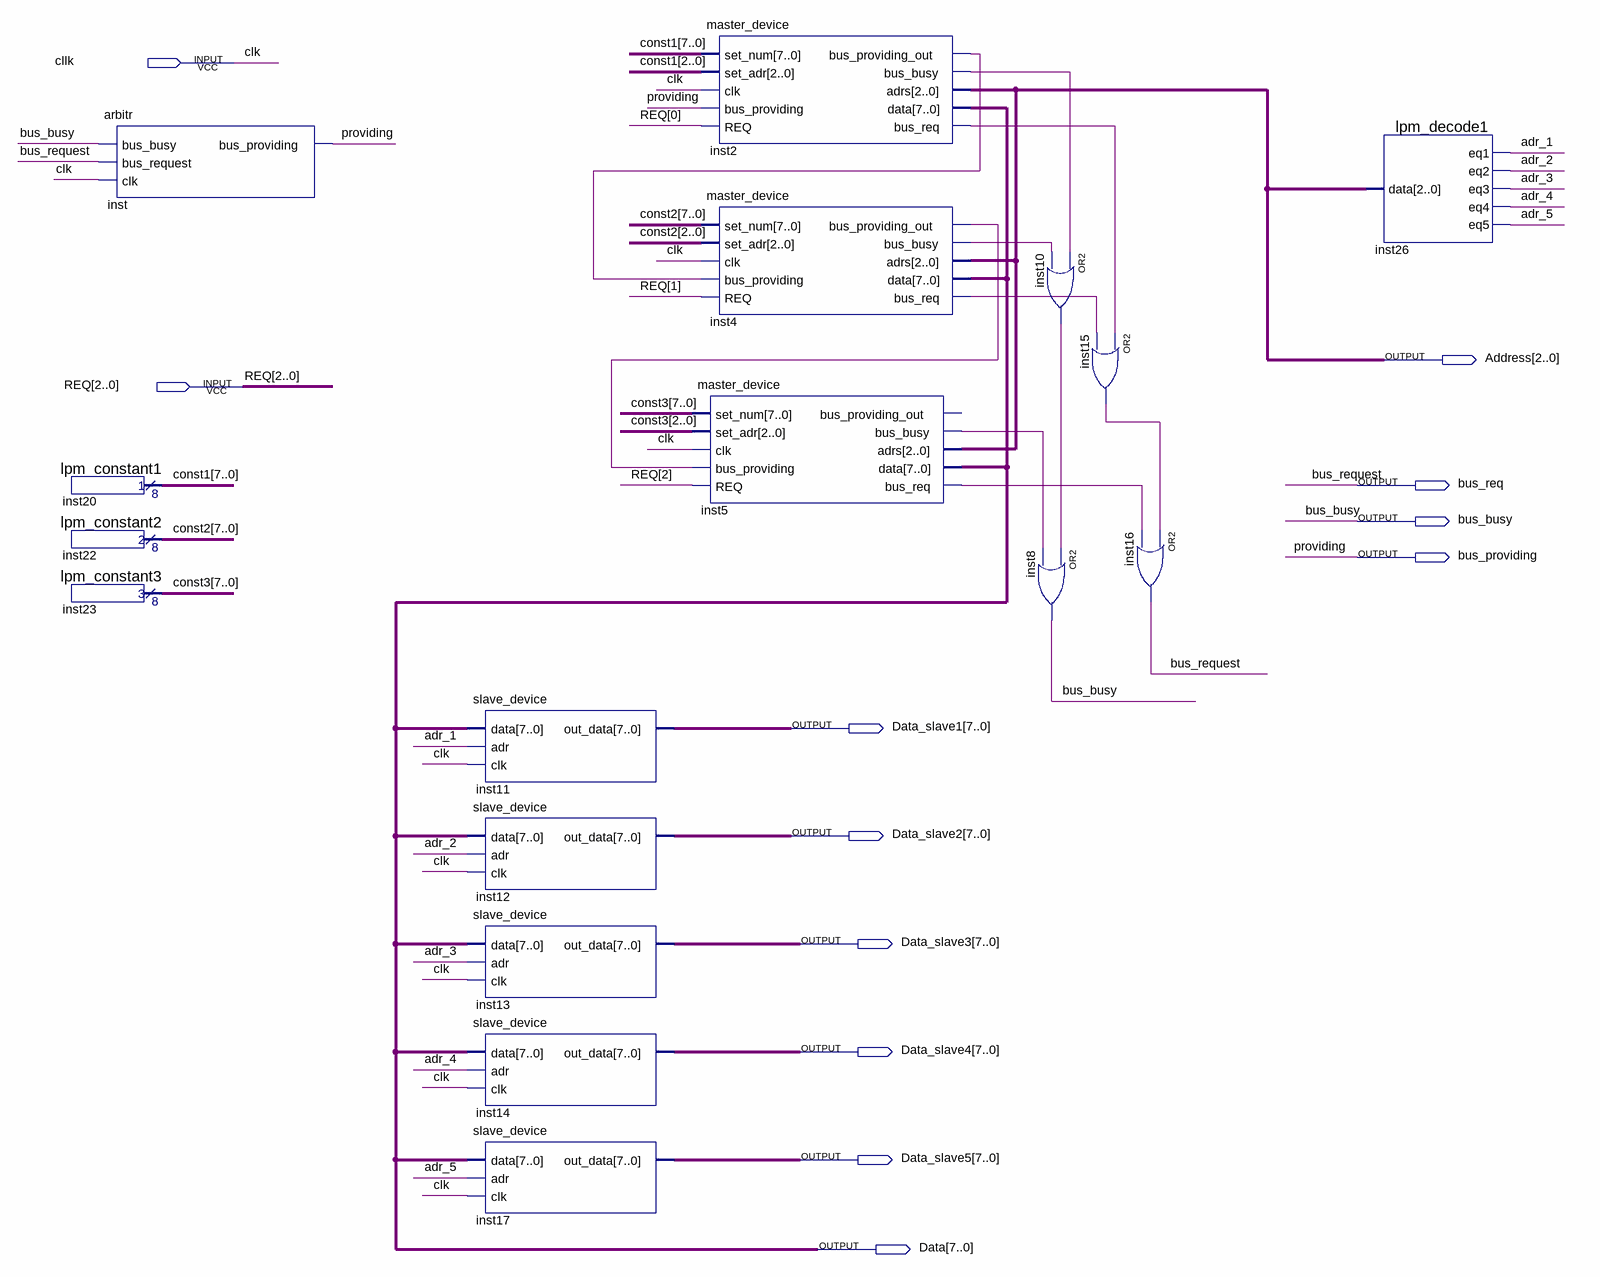
[diagram p0: schematic sheet]
// Quartus schematic lab7var2.bdf as structural Verilog: 17 symbols, 12 pins
module lab7var2 (
  input  cllk,
  input  [2:0] REQ,
  output [2:0] Address,
  output bus_req,
  output bus_busy,
  output bus_providing,
  output [7:0] Data_slave1,
  output [7:0] Data_slave2,
  output [7:0] Data_slave3,
  output [7:0] Data_slave4,
  output [7:0] Data_slave5,
  output [7:0] Data
);

  wire adr_1, adr_2, adr_3, adr_4, adr_5, inst2_bus_busy, inst2_bus_providing_out, inst2_bus_req,
       inst4_bus_busy, inst4_bus_providing_out, inst4_bus_req, inst5_bus_busy, inst5_bus_req, inst10_out,
       inst15_out;
  wire [7:0] const1, const2, const3;

  arbitr inst (.bus_busy(bus_busy), .bus_request(bus_req), .clk(cllk), .bus_providing(bus_providing));
  lpm_constant1 inst20 (.result(const1));
  lpm_constant2 inst22 (.result(const2));
  lpm_constant3 inst23 (.result(const3));
  slave_device inst11 (.data(Data), .adr(adr_1), .clk(cllk), .out_data(Data_slave1));
  slave_device inst12 (.data(Data), .adr(adr_2), .clk(cllk), .out_data(Data_slave2));
  slave_device inst13 (.data(Data), .adr(adr_3), .clk(cllk), .out_data(Data_slave3));
  slave_device inst14 (.data(Data), .adr(adr_4), .clk(cllk), .out_data(Data_slave4));
  slave_device inst17 (.data(Data), .adr(adr_5), .clk(cllk), .out_data(Data_slave5));
  master_device inst5 (
    .set_num(const3), .set_adr(const3[2:0]), .clk(cllk), .bus_providing(inst4_bus_providing_out),
    .REQ(REQ[2]), .bus_busy(inst5_bus_busy), .data(Data), .bus_req(inst5_bus_req), .adrs(Address));  // open: bus_providing_out
  master_device inst2 (
    .set_num(const1), .set_adr(const1[2:0]), .clk(cllk), .bus_providing(bus_providing), .REQ(REQ[0]),
    .bus_providing_out(inst2_bus_providing_out), .bus_busy(inst2_bus_busy), .data(Data),
    .bus_req(inst2_bus_req), .adrs(Address));
  master_device inst4 (
    .set_num(const2), .set_adr(const2[2:0]), .clk(cllk), .bus_providing(inst2_bus_providing_out),
    .REQ(REQ[1]), .bus_providing_out(inst4_bus_providing_out), .bus_busy(inst4_bus_busy), .data(Data),
    .bus_req(inst4_bus_req), .adrs(Address));
  or inst10 (inst10_out, inst2_bus_busy, inst4_bus_busy);
  or inst8 (bus_busy, inst10_out, inst5_bus_busy);
  or inst15 (inst15_out, inst2_bus_req, inst4_bus_req);
  or inst16 (bus_req, inst15_out, inst5_bus_req);
  lpm_decode1 inst26 (.data(Address), .eq1(adr_1), .eq2(adr_2), .eq3(adr_3), .eq4(adr_4), .eq5(adr_5));

  // Other names for the same wires on the sheet: bus_request = bus_req; clk = cllk; providing = bus_providing
endmodule
